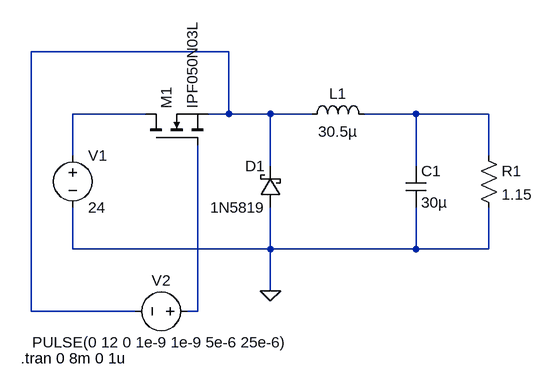
[diagram p0: schematic Buck_Converter_LTspice_Simulation.asc]
Buck_Converter_LTspice_Simulation.asc, the LTspice schematic file:
Version 4
SHEET 1 880 680
WIRE 64 0 -240 0
WIRE -64 96 -176 96
WIRE 64 96 64 0
WIRE 64 96 32 96
WIRE 128 96 64 96
WIRE 192 96 128 96
WIRE 352 96 272 96
WIRE 464 96 352 96
WIRE -176 160 -176 96
WIRE 464 160 464 96
WIRE 128 176 128 96
WIRE 352 176 352 96
WIRE -176 304 -176 240
WIRE 128 304 128 240
WIRE 128 304 -176 304
WIRE 352 304 352 240
WIRE 352 304 128 304
WIRE 464 304 464 240
WIRE 464 304 352 304
WIRE 128 368 128 304
WIRE -240 400 -240 0
WIRE -80 400 -240 400
WIRE 16 400 16 144
WIRE 16 400 0 400
FLAG 128 368 0
SYMBOL res 448 144 R0
SYMATTR InstName R1
SYMATTR Value 1.15
SYMBOL schottky 144 240 R180
WINDOW 0 24 64 Left 2
WINDOW 3 24 0 Left 2
SYMATTR InstName D1
SYMATTR Value 1N5819
SYMATTR Description Diode
SYMATTR Type diode
SYMBOL cap 336 176 R0
SYMATTR InstName C1
SYMATTR Value 30µ
SYMBOL voltage -176 144 R0
WINDOW 123 0 0 Left 0
WINDOW 39 0 0 Left 0
SYMATTR InstName V1
SYMATTR Value 24
SYMBOL ind 176 112 R270
WINDOW 0 32 56 VTop 2
WINDOW 3 5 56 VBottom 2
SYMATTR InstName L1
SYMATTR Value 30.5µ
SYMBOL nmos -64 144 R270
SYMATTR InstName M1
SYMATTR Value IPF050N03L
SYMBOL voltage 16 400 R90
WINDOW 0 -32 56 VBottom 2
WINDOW 3 32 56 VTop 2
WINDOW 123 0 0 Left 0
WINDOW 39 0 0 Left 0
SYMATTR InstName V2
SYMATTR Value PULSE(0 12 0 1e-9 1e-9 5e-6 25e-6)
TEXT -256 472 Left 2 !.tran 0 8m 0 1u

The netlist it stands for:
* Buck_Converter_LTspice_Simulation.asc
R1 N003 0 1.15
D1 0 N001 1N5819
C1 N003 0 30µ
V1 N002 0 24
L1 N001 N003 30.5µ
M1 N002 N004 N001 N001 IPF050N03L
V2 N004 N001 PULSE(0 12 0 1e-9 1e-9 5e-6 25e-6)
.model D D
.lib standard.dio
.model NMOS NMOS
.model PMOS PMOS
.lib standard.mos
.tran 0 8m 0 1u
.backanno
.end